# Altium project Logger.PrjPcb
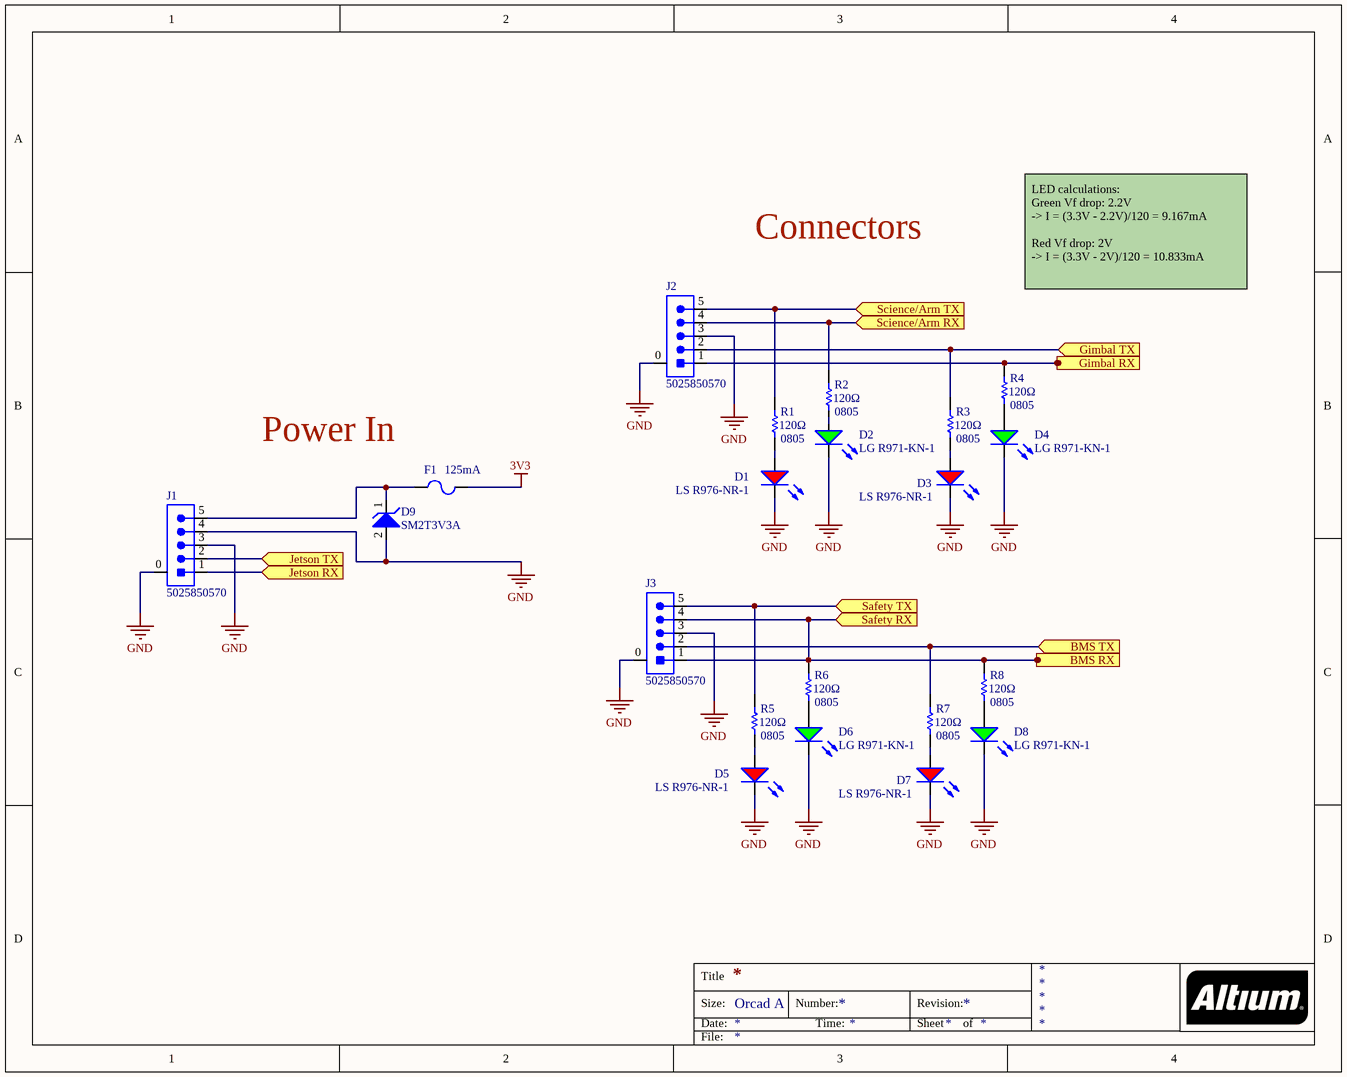
[diagram p0: SH1 - Connectors.SchDoc]
2 sheets, 49 parts. Net scope: flat (ports and power ports of the same name join across sheets).
Sheets:
  SH1 - Connectors.SchDoc
  SH2 - Microcontroller.SchDoc

## Sheet SH1 - Connectors.SchDoc
size OrCAD A

### Parts
D1  LS R976-NR-1  [LED_0805_LINE]
D2  LG R971-KN-1  [LED_0805_LINE]
D3  LS R976-NR-1  [LED_0805_LINE]
D4  LG R971-KN-1  [LED_0805_LINE]
D5  LS R976-NR-1  [LED_0805_LINE]
D6  LG R971-KN-1  [LED_0805_LINE]
D7  LS R976-NR-1  [LED_0805_LINE]
D8  LG R971-KN-1  [LED_0805_LINE]
D9  Manufacturer Part Number: SM2T3V3A  [TVS_DIODE_UNIDIR]  (hidden comment: TVS_DIODE_UNIDIR_3.3V)
F1  Current Rating: 125mA  [FUSE_1206]  (hidden comment: FUSE_125mA_1206)
J1  Manufacturer Part Number 1: 5025850570  [MOLEX-5025850570]  (hidden comment: CON_5M_SM_RA)
J2  Manufacturer Part Number 1: 5025850570  [MOLEX-5025850570]  (hidden comment: CON_5M_SM_RA)
J3  Manufacturer Part Number 1: 5025850570  [MOLEX-5025850570]  (hidden comment: CON_5M_SM_RA)
R1  Case Code (Imperial): 0805  Resistance: 120Ω  [RESC2012X60N]  (hidden comment: 120)
R2  Case Code (Imperial): 0805  Resistance: 120Ω  [RESC2012X60N]  (hidden comment: 120)
R3  Case Code (Imperial): 0805  Resistance: 120Ω  [RESC2012X60N]  (hidden comment: 120)
R4  Case Code (Imperial): 0805  Resistance: 120Ω  [RESC2012X60N]  (hidden comment: 120)
R5  Case Code (Imperial): 0805  Resistance: 120Ω  [RESC2012X60N]  (hidden comment: 120)
R6  Case Code (Imperial): 0805  Resistance: 120Ω  [RESC2012X60N]  (hidden comment: 120)
R7  Case Code (Imperial): 0805  Resistance: 120Ω  [RESC2012X60N]  (hidden comment: 120)
R8  Case Code (Imperial): 0805  Resistance: 120Ω  [RESC2012X60N]  (hidden comment: 120)

### Ports
BMS RX (in), BMS TX (in), Gimbal RX (in), Gimbal TX (in), Jetson RX (in), Jetson TX (in), Safety RX (in), Safety TX (in), Science/Arm RX (in), Science/Arm TX (in)

### Nets
3V3: F1.2
GND: D1.2(K) D2.2(K) D3.2(K) D4.2(K) D5.2(K) D6.2(K) D7.2(K) D8.2(K) D9.2 J1.0 J1.3 J1.4 J2.0 J2.3 J3.0 J3.3
NetD1_1: D1.1(A) R1.2
NetD2_1: D2.1(A) R2.2
NetD3_1: D3.1(A) R3.2
NetD4_1: D4.1(A) R4.2
NetD5_1: D5.1(A) R5.2
NetD6_1: D6.1(A) R6.2
NetD7_1: D7.1(A) R7.2
NetD8_1: D8.1(A) R8.2
NetD9_1: D9.1 F1.1 J1.5
NetJ1_1: J1.1 ; port Jetson RX
NetJ1_2: J1.2 ; port Jetson TX
NetJ2_1: J2.1 R4.1 ; port Gimbal RX
NetJ2_2: J2.2 R3.1 ; port Gimbal TX
NetJ2_4: J2.4 R2.1 ; port Science/Arm RX
NetJ2_5: J2.5 R1.1 ; port Science/Arm TX
NetJ3_1: J3.1 J3.4 R6.1 R8.1 ; port Safety RX, port BMS RX
NetJ3_2: J3.2 R7.1 ; port BMS TX
NetJ3_5: J3.5 R5.1 ; port Safety TX

### Notes on the sheet
- Connectors
- LED calculations:
  Green Vf drop: 2.2V
  -> I = (3.3V - 2.2V)/120 = 9.167mA
  Red Vf drop: 2V
  -> I = (3.3V - 2V)/120 = 10.833mA
- Power In
- Title
- Size:
- Date:
- Orcad A
- Number:
- Time:
- Revision:
- Sheet
- of
- File:

### Library data of the parts
D1 D3 D5 D7 = DIO_LED_R: LED RED DIFFUSED 0805 SMD; Manufacturer 1: OSRAM; Forward Voltage Drop: 2V; Package: 0805 (2012 Metric); Supplier Part Number 1: 475-1278-1-ND; Supplier 1: Digi-Key; Mount: Surface Mount; Manufacturer Part Number 1: LS R976-NR-1
D2 D4 D6 D8 = DIO_LED_G: LED GREEN DIFFUSED 0805 SMD; Manufacturer 1: OSRAM; Forward Voltage Drop: 2.2V; Package: 0805 (2012 Metric); Supplier Part Number 1: 475-1410-1-ND; Supplier 1: Digi-Key; Mount: Surface Mount; Manufacturer Part Number 1: LG R971-KN-1
D9 = TVS_DIODE_UNIDIR_3.3V: TVS DIODE 3.3V 6.8V DO216AA; Manufacturer: STMicroelectronics; Direction: Unidirectional; Peak Pulse Power: 200W; Min Breakdown Voltage: 3.6V; Peak Pulse Current: 30A; Power Line Protection: No; Test Current: 1mA; Max Reverse Leakage Current: 500uA; Max Power Dissipation: 2.5W; Number of Channels: 1; Element Configuration: Single; ESD Protection: Yes; Supplier 1: Digi-Key; RoHS: Yes; Category: TVS Diodes; Stock 1: 22979; Pricing 1: 1=0.39000, 10=0.33800, 25=0.31520, 100=0.23400, 500=0.18270, 1000=0.14850, 2500=0.13950, 5000=0.12600 (USD); Mount: Surface Mount; Number of Pins: 2; Contact Plating: Tin,Matte; Min Operating Temperature: -65°C; Max Operating Temperature: 150°C; Reverse Standoff Voltage: 3.3V; Packaging: Tape and Reel; Clamping Voltage: 6.8V; Polarity: Unidirectional; Composition: Zener; Package Quantity: 1; Reverse Breakdown Voltage: 3.6V; Breakdown Voltage: 3.6V; Termination: SMD/SMT; Number of Unidirectional Channels: 1; Number of Elements: 1; Max Breakdown Voltage: 3.6V; Leakage Current: 500uA; Operating Supply Voltage: 3.3V; Max Surge Current: 30A; Power Dissipation: 2.5W; Length: 2.05mm; Height: 1.15mm; Width: 2.05mm; Radiation Hardening: No; Lead Free: Lead Free; REACH SVHC: No SVHC; ComponentLink1URL: https://datasheet.ciiva.com:443/pdfs/VipMasterIC/IC/SGST/SGST-S-A0001375484/SGST-S-A0001375484-1.pdf?src-supplier=IHS+Markit; ComponentLink1Description: https://datasheet.ciiva.com:443/pdfs/VipMasterIC/IC/SGST/SGST-S-A0001375484/SGST-S-A0001375484-1.pdf?src-supplier=IHS+Markit; ComponentLink2URL: https://datasheet.ciiva.com/4510/cd00070945-4510608.pdf?src-supplier=Mouser; ComponentLink2Description: https://datasheet.ciiva.com/4510/cd00070945-4510608.pdf?src-supplier=Mouser; ComponentLink3URL: https://datasheet.ciiva.com/15143/getdatasheetpartid-143099-15143712.pdf?src-supplier=Verical; ComponentLink3Description: https://datasheet.ciiva.com/15143/getdatasheetpartid-143099-15143712.pdf?src-supplier=Verical; ComponentLink4URL: https://datasheet.ciiva.com/5783/1312058-5783003.pdf?src-supplier=Farnell; ComponentLink4Description: https://datasheet.ciiva.com/5783/1312058-5783003.pdf?src-supplier=Farnell; ComponentLink5URL: https://datasheet.ciiva.com/338/cd00070945-338292.pdf?src-supplier=Digi-Key; ComponentLink5Description: https://datasheet.ciiva.com/338/cd00070945-338292.pdf?src-supplier=Digi-Key; ComponentLink6URL: https://datasheet.ciiva.com/338/cd00070945-338293.pdf?src-supplier=Digi-Key; ComponentLink6Description: https://datasheet.ciiva.com/338/cd00070945-338293.pdf?src-supplier=Digi-Key; ComponentLink7URL: https://datasheet.ciiva.com/338/cd00070945-338294.pdf?src-supplier=Digi-Key; ComponentLink7Description: https://datasheet.ciiva.com/338/cd00070945-338294.pdf?src-supplier=Digi-Key; ComponentLink8URL: https://datasheet.ciiva.com/22695/1794551-22695687.pdf?src-supplier=Element14; ComponentLink8Description: https://datasheet.ciiva.com/22695/1794551-22695687.pdf?src-supplier=Element14; ComponentLink9URL: https://datasheet.ciiva.com/7973/1794551-7973387.pdf?src-supplier=Element14; ComponentLink9Description: https://datasheet.ciiva.com/7973/1794551-7973387.pdf?src-supplier=Element14; ComponentLink10URL: https://datasheet.ciiva.com/41443/001184275-da-01-en-transil-low-volt-u-sm2t3v3a-do-216aa-stm-41443543.pdf?src-supplier=Conrad; ComponentLink10Description: https://datasheet.ciiva.com/41443/001184275-da-01-en-transil-low-volt-u-sm2t3v3a-do-216aa-stm-41443543.pdf?src-supplier=Conrad; Supplier Part Number 1: 497-7878-1-ND
F1 = FUSE_125mA_1206: FUSE SMD 125mA 125V; Manufacturer 1: Littelfuse; Manufacturer Part Number 1: 0466.125NRHF; DC Cold Resistance: 4R; Fuse Type: Board Mount (Cartridge Style Excluded); Power Dissipation: 69.1mW; Approvals: UL,CSA; Supplier 1: Digi-Key; Mount: Surface Mount; Case/Package: 1206; Case Code (Metric): 3216; Case Code (Imperial): 1206; Housing Material: Ceramic; Min Operating Temperature: -55°C; Max Operating Temperature: 90°C; Voltage Rating (AC): 125V; Voltage Rating (DC): 125V; Working Voltage: 125V; Length: 3.18mm; Height: 0.023inch; Depth: 1.52mm; Width: 0.06inch; Supplier Part Number 1: F6016CT-ND
J1-J3 = CON_5M_SM_RA: CONN HEADER SMD RIGHT ANGLE 1.5MM PITCH; Manufacturer 1: Molex; Connector Type: Receptacle,Center Strip Contact; Number of Positions: 5; Current Rating: 2A; Supplier 1: Digi-Key; Mount: Surface Mount; Termination: Solder; Number of Contacts: 5; Orientation: Right Angle; Number of Circuits: 5; Number of Rows: 1; Supplier Part Number 1: WM14469CT-ND
R1-R8 = RES_120Ω_0805: RES SMD 120 OHM 1% 1/8W 0805; Manufacturer 1: Vishay; Manufacturer Part Number 1: CRCW0805120RFKEA; Power Rating: 125mW; Voltage Rating: 150V; ComponentLink7URL: https://datasheet.ciiva.com/2467/dcrcwe3-2467513.pdf?src-supplier=Digi-Key; ComponentLink7Description: https://datasheet.ciiva.com/2467/dcrcwe3-2467513.pdf?src-supplier=Digi-Key; ComponentLink8URL: https://datasheet.ciiva.com/16852/dcrcwe3-16852841.pdf?src-supplier=Avnet+Europe; ComponentLink8Description: https://datasheet.ciiva.com/16852/dcrcwe3-16852841.pdf?src-supplier=Avnet+Europe; ComponentLink9URL: https://datasheet.ciiva.com/7777/1697337-7777354.pdf?src-supplier=Element14; ComponentLink9Description: https://datasheet.ciiva.com/7777/1697337-7777354.pdf?src-supplier=Element14; ComponentLink10URL: https://datasheet.ciiva.com/16788/70201119-16788154.pdf?src-supplier=Allied+Electronics; ComponentLink10Description: https://datasheet.ciiva.com/16788/70201119-16788154.pdf?src-supplier=Allied+Electronics; ComponentLink11URL: https://datasheet.ciiva.com/7777/1720486-7777567.pdf?src-supplier=Element14; ComponentLink11Description: https://datasheet.ciiva.com/7777/1720486-7777567.pdf?src-supplier=Element14; Supplier 1: Digi-Key; Mount: Surface Mount; Case Code (Metric): 2012; Supplier Part Number 1: 541-120CCT-ND; Package: 0805 (2012 Metric)

## Sheet SH2 - Microcontroller.SchDoc
size Letter
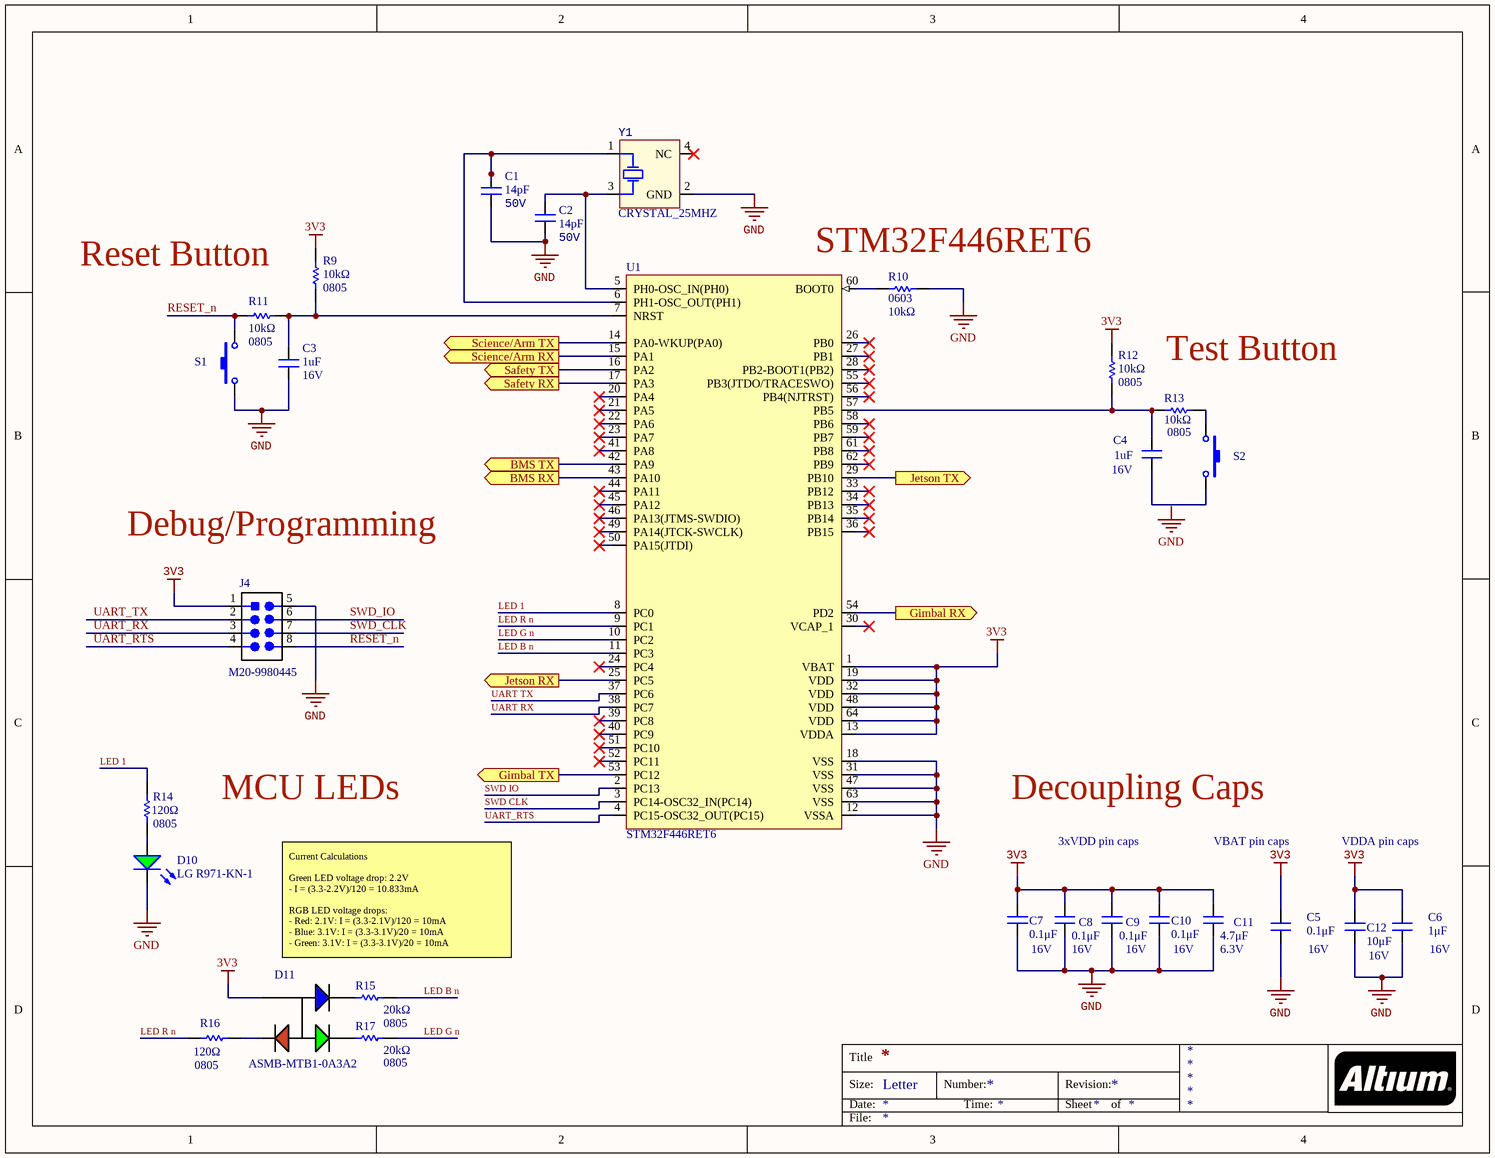
[diagram p1: SH2 - Microcontroller.SchDoc]

### Parts
C1  value 14pF  Voltage Rating (DC): 50V  [CAPC0603(1608)55_N]  (hidden comment: CL10C140JB8NNNC)
C2  value 14pF  Voltage Rating (DC): 50V  [CAPC0603(1608)55_N]  (hidden comment: CL10C140JB8NNNC)
C3  value 1uF  Voltage Rating: 16V  [CAPC2012X140N]  (hidden comment: CAP_1uF_16V_0805)
C4  value 1uF  Voltage Rating: 16V  [CAPC2012X140N]  (hidden comment: CAP_1uF_16V_0805)
C5  value 0.1μF  Voltage Rating: 16V  [CAPC0603(1608)55_N]  (hidden comment: CAP_0.1uF_16V_0603)
C6  value 1μF  Voltage Rating: 16V  [CAPC0603(1608)55_N]  (hidden comment: CAP_1uF_16V_0603)
C7  value 0.1μF  Voltage Rating: 16V  [CAPC0603(1608)55_N]  (hidden comment: CAP_0.1uF_16V_0603)
C8  value 0.1μF  Voltage Rating: 16V  [CAPC0603(1608)55_N]  (hidden comment: CAP_0.1uF_16V_0603)
C9  value 0.1μF  Voltage Rating: 16V  [CAPC0603(1608)55_N]  (hidden comment: CAP_0.1uF_16V_0603)
C10  value 0.1μF  Voltage Rating: 16V  [CAPC0603(1608)55_N]  (hidden comment: CAP_0.1uF_16V_0603)
C11  value 4.7μF  Voltage Rating: 6.3V  [CAPC0603(1608)55_N]  (hidden comment: CAP_4.7uF_0603)
C12  value 10μF  Voltage Rating: 16V  [CAPC0603(1608)55_N]  (hidden comment: CAP_10nF_0603)
D10  LG R971-KN-1  [LED_0805_LINE]
D11  Manufacturer Part Number 1: ASMB-MTB1-0A3A2  [LED_RGB]  (hidden comment: LED_RGB)
J4  Manufacturer Part Number 1: M20-9980445  [HEADER_2X4]  (hidden comment: HEADER 4X2)
R9  value 10kΩ  Case Code (Imperial): 0805  [RESC2012X60N]  (hidden comment: RES_10kΩ_0805)
R10  value 10kΩ  Case Code (Imperial): 0603  [RESC0603(1608)_N]  (hidden comment: RES_10kΩ_0603)
R11  value 10kΩ  Case Code (Imperial): 0805  [RESC2012X60N]  (hidden comment: RES_10kΩ_0805)
R12  value 10kΩ  Case Code (Imperial): 0805  [RESC2012X60N]  (hidden comment: RES_10kΩ_0805)
R13  value 10kΩ  Case Code (Imperial): 0805  [RESC2012X60N]  (hidden comment: RES_10kΩ_0805)
R14  Case Code (Imperial): 0805  Resistance: 120Ω  [RESC2012X60N]  (hidden comment: 120)
R15  value 20kΩ  Case Code (Imperial): 0805  [RESC2012X60N]  (hidden comment: RES_20kΩ_0805)
R16  Case Code (Imperial): 0805  Resistance: 120Ω  [RESC2012X60N]  (hidden comment: 120)
R17  value 20kΩ  Case Code (Imperial): 0805  [RESC2012X60N]  (hidden comment: RES_20kΩ_0805)
S1  SW_TACTILE  [B3U-1000P]  (value not drawn)
S2  SW_TACTILE  [B3U-1000P]  (value not drawn)
U1  STM32F446RET6  [STM_LQFP64_N]
Y1  CRYSTAL_25MHZ  [SOIC254P1016X440-4N]

### Ports
BMS RX (out), BMS TX (out), Gimbal RX (out), Gimbal TX (out), Jetson RX (out), Jetson TX (out), Safety RX (out), Safety TX (out), Science/Arm RX (out), Science/Arm TX (out)

### Nets
3V3: C5.2 C6.2 C7.2 C8.2 C9.2 C10.2 C11.2 C12.2 D11.4 J4.1(VCC) R9.2 R12.2 U1.1(VBAT) U1.13(VDDA) U1.19(VDD) U1.32(VDD) U1.48(VDD) U1.64(VDD)
GND: C1.1 C2.1 C3.1 C5.1 C6.1 C7.1 C8.1 C9.1 C10.1 C11.1 C12.1 D10.2(K) J4.5(GND) R10.2 S1.2 U1.12(VSSA) U1.18(VSS) U1.31(VSS) U1.47(VSS) U1.63(VSS) Y1.2(GND)
LED 1: R14.1 U1.8(PC0)
LED B n: R15.2 U1.11(PC3)
LED G n: R17.2 U1.10(PC2)
LED R n: R16.1 U1.9(PC1)
RESET_n: J4.8 R11.1 S1.1
SWD CLK: U1.3(PC14-OSC32_IN(PC14))
SWD IO: U1.2(PC13)
SWD_CLK: J4.7
SWD_IO: J4.6
UART RX: U1.38(PC7)
UART TX: U1.37(PC6)
UART_RTS: J4.4 U1.4(PC15-OSC32_OUT(PC15))
UART_RX: J4.3
UART_TX: J4.2
NetC1_2: C1.2 U1.6(PH1-OSC_OUT(PH1)) Y1.1(HOT)
NetC2_2: C2.2 U1.5(PH0-OSC_IN(PH0)) Y1.3(HOT)
NetC3_2: C3.2 R9.1 R11.2 U1.7(NRST)
NetC4_1: C4.1 S2.2
NetC4_2: C4.2 R12.1 R13.1 U1.57(PB5)
NetD10_1: D10.1(A) R14.2
NetD11_1: D11.1 R16.2
NetD11_2: D11.2 R17.1
NetD11_3: D11.3 R15.1
NetJ1_1: U1.25(PC5) ; port Jetson RX
NetJ1_2: U1.29(PB10) ; port Jetson TX
NetJ2_1: U1.54(PD2) ; port Gimbal RX
NetJ2_2: U1.53(PC12) ; port Gimbal TX
NetJ2_4: U1.15(PA1) ; port Science/Arm RX
NetJ2_5: U1.14(PA0-WKUP(PA0)) ; port Science/Arm TX
NetJ3_1: U1.17(PA3) U1.43(PA10) ; port BMS RX, port Safety RX
NetJ3_2: U1.42(PA9) ; port BMS TX
NetJ3_5: U1.16(PA2) ; port Safety TX
NetR10_1: R10.1 U1.60(BOOT0)
NetR13_2: R13.2 S2.1

Not connected (* = marked no-connect by the designer): U1 20(PA4)* 21(PA5)* 22(PA6)* 23(PA7)* 24(PC4)* 26(PB0)* 27(PB1)* 28(PB2-BOOT1(PB2))* 30(VCAP_1)* 33(PB12)* 34(PB13)* 35(PB14)* 36(PB15)* 39(PC8)* 40(PC9)* 41(PA8)* 44(PA11)* 45(PA12)* 46(PA13(JTMS-SWDIO))* 49(PA14(JTCK-SWCLK))* 50(PA15(JTDI))* 51(PC10)* 52(PC11)* 55(PB3(JTDO/TRACESWO))* 56(PB4(NJTRST))* 58(PB6)* 59(PB7)* 61(PB8)* 62(PB9)*; Y1 4(NC)*

### Notes on the sheet
- (near R9) Reset Button
- STM32F446RET6
- Test Button
- Debug/Programming
- MCU LEDs
- Decoupling Caps
- 3xVDD pin caps
- VBAT pin caps
- VDDA pin caps
- Current Calculations
  Green LED voltage drop: 2.2V
  - I = (3.3-2.2V)/120 = 10.833mA
  RGB LED voltage drops:
  - Red: 2.1V: I = (3.3-2.1V)/120 = 10mA
  - Blue: 3.1V: I = (3.3-3.1V)/20 = 10mA
  - Green: 3.1V: I = (3.3-3.1V)/20 = 10mA
- Labels drawn without touching a wire or pin: GND
- Title
- Size:
- Date:
- Letter
- Number:
- Time:
- Revision:
- Sheet
- of
- File:

### Library data of the parts
C1 C2 = CL10C140JB8NNNC: Cap Ceramic 14pF 50V C0G 5% SMD 0603 125C Cardboard T/R; Manufacturer 1: Samsung; Voltage Rating: 50V; Supplier Part Number 1: 1276-2187-1-ND; Supplier 1: Digi-Key; Manufacturer Part Number 1: CL10C140JB8NNNC; Stock 1: 187088; Pricing 1: 1=0.10000, 10=0.06700, 100=0.02980, 500=0.02130, 1000=0.01673 (USD); RoHS: Yes; Mount: Surface Mount; Case/Package: 0603; Case Code (Metric): 1608; Case Code (Imperial): 0603; Min Operating Temperature: -55°C; Max Operating Temperature: 125°C; Tolerance: 5%; Package Quantity: 1; Packaging: Tape and Reel; Dielectric: C0G; Length: 1.6mm; Height: 0.8mm; Width: 0.031inch; Depth: 0.8mm; Thickness: 0.035inch; Radiation Hardening: No; ComponentLink1URL: https://datasheet.ciiva.com/25782/cl10c140jb8nnnc-25782947.pdf?src-supplier=Digi-Key; ComponentLink1Description: https://datasheet.ciiva.com/25782/cl10c140jb8nnnc-25782947.pdf?src-supplier=Digi-Key; Capacitance: 14pF
C3 C4 = CAP_1uF_16V_0805: CAP CER 1UF 16V X7R 0805; Manufacturer 1: Yageo; Manufacturer Part Number 1: CC0805KKX7R7BB105; Tolerance: 10%; Mount: Surface Mount; Case/Package: 0805; Case Code (Metric): 2012; Case Code (Imperial): 0805; Min Operating Temperature: -55°C; Max Operating Temperature: 125°C; Capacitance: 1uF; Dielectric: X7R; Termination: SMD/SMT; Supplier 1: Digi-Key; Supplier Part Number 1: 311-1365-1-ND
C5 C7-C10 = CAP_0.1uF_16V_0603: CAP CER 0.1UF 16V X7R 0603; Manufacturer Part Number 1: CC0603KRX7R7BB104; Manufacturer 1: Yageo; Dimensions: 0.063" L x 0.031" W (1.60mm x 0.80mm); Package: 0603 (1608 Metric); Temperature Coefficient: X7R; Supplier Part Number 1: 311-1088-1-ND; Supplier 1: Digi-Key; Mount: Surface Mount; Case Code (Imperial): 0603; Case Code (Metric): 1608; Dielectric: X7R
C6 = CAP_1uF_16V_0603: CAP CER 1UF 16V Y5V 0603; Manufacturer Part Number: CC0603ZRY5V7BB105; Manufacturer 1: Yageo; Dimensions: 0.063" L x 0.031" W (1.60mm x 0.80mm); Package: 0603 (1608 Metric); Temperature Coefficient: Y5V; Supplier Part Number 1: 311-1372-1-ND; Supplier 1: Digi-Key; Mount: Surface Mount; Case Code (Imperial): 0603; Case Code (Metric): 1608; Manufacturer Part Number 1: CC0603ZRY5V7BB105; Dielectric: Y5V
C11 = CAP_4.7uF_0603: CAP CER 4.7UF 6.3V X5R 0603; Manufacturer Part Number 1: CC0603KRX5R5BB475; Manufacturer 1: Yageo; Dimensions: 0.063" L x 0.031" W (1.60mm x 0.80mm); Package: 0603 (1608 Metric); Temperature Coefficient: X5R; Supplier Part Number 1: 311-1521-1-ND; Supplier 1: Digi-Key; Mount: Surface Mount; Case Code (Imperial): 0603; Case Code (Metric): 1608; Dielectric: X5R
C12 = CAP_10nF_0603: CAP CER 10000PF 16V X7R 0603; Manufacturer Part Number 1: CC0603KRX7R7BB103; Manufacturer 1: Yageo; Dimensions: 0.063" L x 0.031" W (1.60mm x 0.80mm); Package: 0603 (1608 Metric); Temperature Coefficient: X7R; Supplier Part Number 1: 311-3369-1-ND; Supplier 1: Digi-Key; Mount: Surface Mount; Case Code (Imperial): 0603; Case Code (Metric): 1608; Dielectric: X7R
D10 = DIO_LED_G: as D2 on sheet SH1 - Connectors; Package: 0805 (2012 Metric); Supplier Part Number 1: 475-1410-1-ND; Supplier 1: Digi-Key; Mount: Surface Mount; Manufacturer Part Number 1: LG R971-KN-1
D11 = LED_RGB: LED RGB DIFFUSED 4PLCC SMD; Manufacturer 1: Broadcom; Color: Blue,Green,Red; Lens Color: White; Viewing Angle: 115°; Lens Style: Round; Luminous Intensity: 350mcd; Dominant Wavelength: 470nm; Forward Voltage: 3.1V; Test Current: 20mA; Supplier 1: Digi-Key; Stock 1: 142531; Pricing 1: 1=0.60000, 10=0.47100, 100=0.30210, 500=0.25980, 1000=0.20059 (USD); RoHS: Yes; Mount: Surface Mount; Case/Package: PLCC; Number of Pins: 4; Packaging: Cut Tape; Lens Transparency: Diffused; Length: 3.2mm; Height: 1.9mm; Width: 2.8mm; REACH SVHC: No SVHC; ComponentLink1URL: http://www.farnell.com/datasheets/2111106.pdf?src-supplier=Farnell; ComponentLink1Description: http://www.farnell.com/datasheets/2111106.pdf?src-supplier=Farnell; ComponentLink2URL: https://docs.broadcom.com/docs/AV02-4194EN?src-supplier=Digi-Key; ComponentLink2Description: https://docs.broadcom.com/docs/AV02-4194EN?src-supplier=Digi-Key; ComponentLink3URL: http://www.farnell.com/datasheets/1801564.pdf?src-supplier=Element14; ComponentLink3Description: http://www.farnell.com/datasheets/1801564.pdf?src-supplier=Element14; ComponentLink4URL: http://www.farnell.com/datasheets/2111106.pdf?src-supplier=Newark; ComponentLink4Description: http://www.farnell.com/datasheets/2111106.pdf?src-supplier=Newark; Supplier Part Number 1: 516-3280-1-ND
J4 = HEADER 4X2: CONN HEADER VERT 8POS 2.54MM; Manufacturer 1: Harwin Inc.; Supplier Part Number 1: 952-2122-ND; Supplier 1: Digi-Key; Mount: Through Hole
R9 R11-R13 = RES_10kΩ_0805: RES SMD 10K OHM 1% 1/8W 0805; Manufacturer 1: Yageo; Manufacturer Part Number 1: RC0805FR-0710KL; Power Rating: 125mW; Supplier 1: Digi-Key; Case Code (Metric): 2012; Min Operating Temperature: -55°C; Max Operating Temperature: 155°C; Resistance: 10K; Tolerance: 1%; Termination: SMD/SMT; Supplier Part Number 1: 311-10.0KCRCT-ND
R10 = RES_10kΩ_0603: RES SMD 10K OHM 5% 1/10W 0603; Manufacturer 1: Yageo; Manufacturer Part Number 1: RC0603JR-0710KL; Package: 0603 (1608 Metric); Dimensions: 0.063" L x 0.031" W (1.60mm x 0.80mm); Supplier Part Number 1: 311-10KGRCT-ND; Supplier 1: Digi-Key; Mount: Surface Mount; Case Code (Metric): 1608; Tolerance: 5%
R14 R16 = RES_120Ω_0805: as R1 on sheet SH1 - Connectors; ComponentLink7URL: https://datasheet.ciiva.com/2467/dcrcwe3-2467513.pdf?src-supplier=Digi-Key; ComponentLink7Description: https://datasheet.ciiva.com/2467/dcrcwe3-2467513.pdf?src-supplier=Digi-Key; ComponentLink8URL: https://datasheet.ciiva.com/16852/dcrcwe3-16852841.pdf?src-supplier=Avnet+Europe; ComponentLink8Description: https://datasheet.ciiva.com/16852/dcrcwe3-16852841.pdf?src-supplier=Avnet+Europe; ComponentLink9URL: https://datasheet.ciiva.com/7777/1697337-7777354.pdf?src-supplier=Element14; ComponentLink9Description: https://datasheet.ciiva.com/7777/1697337-7777354.pdf?src-supplier=Element14; ComponentLink10URL: https://datasheet.ciiva.com/16788/70201119-16788154.pdf?src-supplier=Allied+Electronics; ComponentLink10Description: https://datasheet.ciiva.com/16788/70201119-16788154.pdf?src-supplier=Allied+Electronics; ComponentLink11URL: https://datasheet.ciiva.com/7777/1720486-7777567.pdf?src-supplier=Element14; ComponentLink11Description: https://datasheet.ciiva.com/7777/1720486-7777567.pdf?src-supplier=Element14; Supplier 1: Digi-Key; Mount: Surface Mount; Case Code (Metric): 2012; Supplier Part Number 1: 541-120CCT-ND; Package: 0805 (2012 Metric)
R15 R17 = RES_20kΩ_0805: RES SMD 20K OHM 1% 1/8W 0805; Manufacturer 1: Yageo; Manufacturer Part Number 1: RC0805FR-0720KL; Power Rating: 125mW; Supplier 1: Digi-Key; Case Code (Metric): 2012; Min Operating Temperature: -55°C; Max Operating Temperature: 155°C; Resistance: 20K; Tolerance: 1%; Termination: SMD/SMT; Supplier Part Number 1: 311-20.0KCRCT-ND; Package: 0805 (2012 Metric)
S1 S2 = SW_TACTILE: Tactile Switch (Grey); Manufacturer 1: Omron Electronics Inc-EMC Div; Manufacturer Part Number 1: B3U-1000P; Supplier 1: Digi-Key; Supplier Part Number 1: SW1020CT-ND; Mount: Surface Mount
U1 = STM32F446RET6: IC MCU 32BIT 512KB FLASH 64LQFP; Manufacturer 1: STMicroelectronics; Manufacturer Part Number 1: LF80CDT-TR; Supplier 1: Digi-Key; Supplier Part Number 1: 497-15376-ND; Mount: Surface Mount
Y1 = CRYSTAL_25MHZ: CRYSTAL 25.0000MHZ 12PF SMD; Manufacturer 1: Kyocera AVX; Manufacturer Part Number 1: CX2520DB25000H0FLJC1; Frequency: 25MHz; ESR (Equivalent Series Resistance): 80R; Frequency Stability: 15ppm; Frequency Tolerance: 10ppm; ComponentLink1Description: https://media.digikey.com/pdf/Data%20Sheets/AVX%20PDFs/CX2520DB_USY1M-H1-16429-00_Spec.pdf?src-supplier=Digi-Key; ComponentLink1URL: https://media.digikey.com/pdf/Data%20Sheets/AVX%20PDFs/CX2520DB_USY1M-H1-16429-00_Spec.pdf?src-supplier=Digi-Key; Supplier 1: Digi-Key; Supplier Part Number 1: 1253-1724-1-ND; Stock 1: 11741; Pricing 1: 1=0.72000, 10=0.63300, 50=0.59120, 100=0.52250, 500=0.49500, 1000=0.41250 (USD); RoHS: Yes; Mount: Surface Mount; Case/Package: SMD/SMT; Min Operating Temperature: -30°C; Max Operating Temperature: 85°C; Packaging: Tape and Reel; Load Capacitance: 12pF; Length: 0.098inch; Height: 0.022inch; Width: 0.079inch; Ratings: AEC-Q200

## Nets that join several sheets
3V3: SH1 - Connectors (F1.2), SH2 - Microcontroller (18 pins)
GND: SH1 - Connectors (16 pins), SH2 - Microcontroller (21 pins)
NetJ1_1: SH1 - Connectors (J1.1), SH2 - Microcontroller (U1.25)
NetJ1_2: SH1 - Connectors (J1.2), SH2 - Microcontroller (U1.29)
NetJ2_1: SH1 - Connectors (J2.1 R4.1), SH2 - Microcontroller (U1.54)
NetJ2_2: SH1 - Connectors (J2.2 R3.1), SH2 - Microcontroller (U1.53)
NetJ2_4: SH1 - Connectors (J2.4 R2.1), SH2 - Microcontroller (U1.15)
NetJ2_5: SH1 - Connectors (J2.5 R1.1), SH2 - Microcontroller (U1.14)
NetJ3_1: SH1 - Connectors (J3.1 J3.4 R6.1 R8.1), SH2 - Microcontroller (U1.17 U1.43)
NetJ3_2: SH1 - Connectors (J3.2 R7.1), SH2 - Microcontroller (U1.42)
NetJ3_5: SH1 - Connectors (J3.5 R5.1), SH2 - Microcontroller (U1.16)